# Altium project CONTROL BARRAS DE CONTEO.PrjPcb
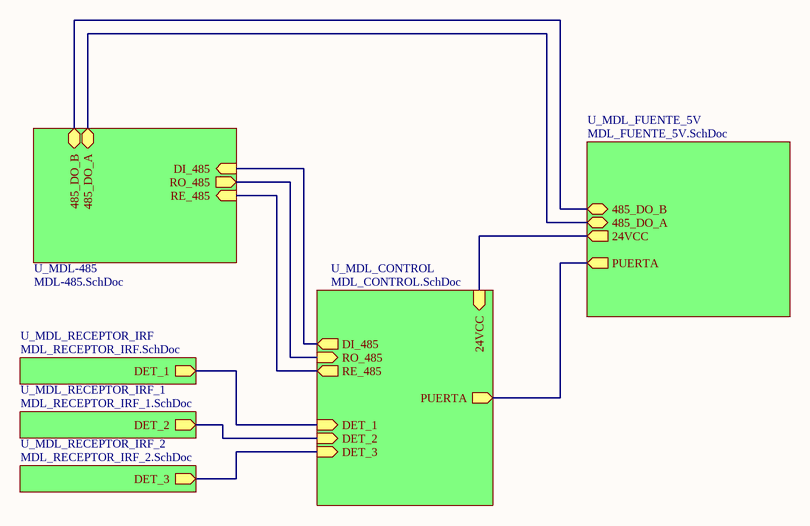
[diagram p0: CPBCC.SchDoc]
5 sheets, 43 parts. Net scope: hierarchical (ports join the sheet entries above them; power ports are global).
Board file: PCB_CPU_1.PcbDoc
Sheets:
  CPBCC.SchDoc
    U_MDL_CONTROL = MDL_CONTROL.SchDoc
    U_MDL-485 = MDL-485.SchDoc
    U_MDL_FUENTE_5V = MDL_FUENTE_5V.SchDoc
    U_MDL_RECEPTOR_IRF = MDL_RECEPTOR_IRF.SchDoc

## Sheet CPBCC.SchDoc
size A4

### Sub-sheets
U_MDL-485 = MDL-485.SchDoc: RO_485 (out), RE_485 (in), DI_485 (in), 485_DO_B (bidir), 485_DO_A (bidir)
U_MDL_CONTROL = MDL_CONTROL.SchDoc: DI_485 (out), RO_485 (in), RE_485 (out), DET_1 (in), DET_2 (in), DET_3 (in), 24VCC (in), PUERTA (out)
U_MDL_FUENTE_5V = MDL_FUENTE_5V.SchDoc: 485_DO_A, PUERTA (out), 485_DO_B, 24VCC (out)
U_MDL_RECEPTOR_IRF = MDL_RECEPTOR_IRF.SchDoc: DET_1 (out)
U_MDL_RECEPTOR_IRF_1 = MDL_RECEPTOR_IRF_1.SchDoc (file not in this document): DET_2 (out)
U_MDL_RECEPTOR_IRF_2 = MDL_RECEPTOR_IRF_2.SchDoc (file not in this document): DET_3 (out)

### Nets
24VCC: sheet U_MDL_CONTROL/24VCC, sheet U_MDL_FUENTE_5V/24VCC
485_DO_A: sheet U_MDL-485/485_DO_A, sheet U_MDL_FUENTE_5V/485_DO_A
485_DO_B: sheet U_MDL-485/485_DO_B, sheet U_MDL_FUENTE_5V/485_DO_B
DET_1: sheet U_MDL_CONTROL/DET_1, sheet U_MDL_RECEPTOR_IRF/DET_1
DET_2: sheet U_MDL_CONTROL/DET_2, sheet U_MDL_RECEPTOR_IRF_1/DET_2
DET_3: sheet U_MDL_CONTROL/DET_3, sheet U_MDL_RECEPTOR_IRF_2/DET_3
DI_485: sheet U_MDL_CONTROL/DI_485, sheet U_MDL-485/DI_485
PUERTA: sheet U_MDL_CONTROL/PUERTA, sheet U_MDL_FUENTE_5V/PUERTA
RE_485: sheet U_MDL_CONTROL/RE_485, sheet U_MDL-485/RE_485
RO_485: sheet U_MDL_CONTROL/RO_485, sheet U_MDL-485/RO_485

## Sheet MDL_CONTROL.SchDoc
size A3
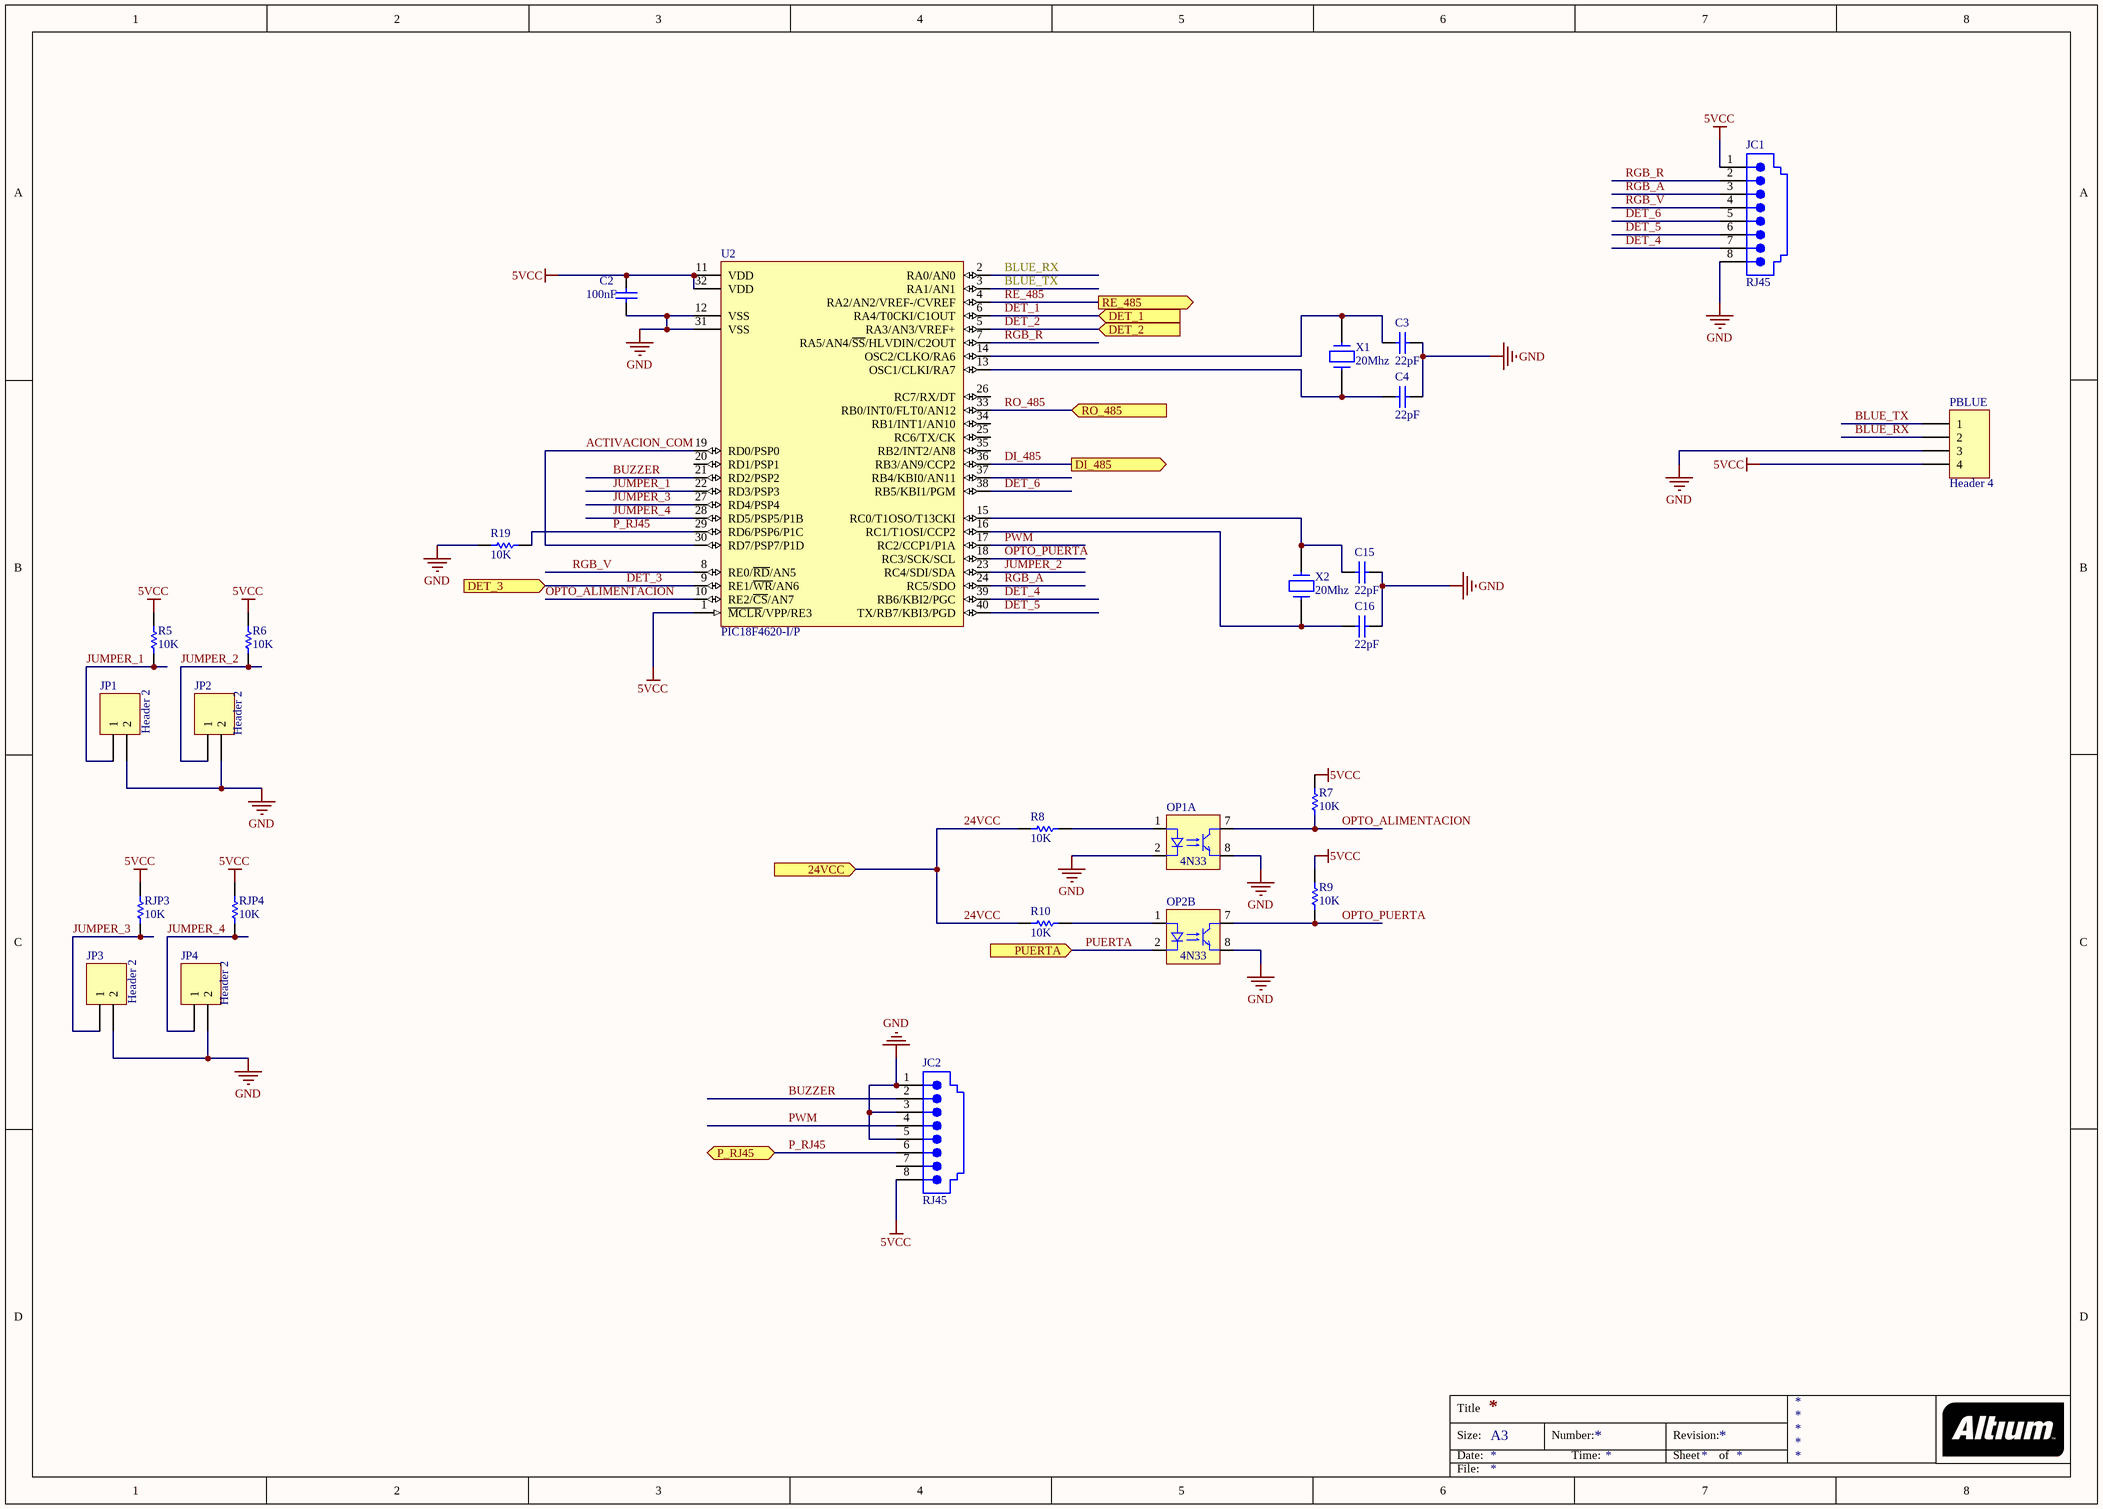
[diagram p1: MDL_CONTROL.SchDoc]

### Parts
C2  value 100nF  [VP44-2.5]  (hidden comment: VP44BY224JB)
C3  value 22pF  [VP31-2.5]  (hidden comment: VP31BA220JB)
C4  value 22pF  [VP31-2.5]  (hidden comment: VP31BA220JB)
C15  value 22pF  [VP31-2.5]  (hidden comment: VP31BA220JB)
C16  value 22pF  [VP31-2.5]  (hidden comment: VP31BA220JB)
JC1  RJ45  [15-43-6233]
JC2  RJ45  [15-43-6233]
JP1  Header 2  [HDR1X2]
JP2  Header 2  [HDR1X2]
JP3  Header 2  [HDR1X2]
JP4  Header 2  [HDR1X2]
OP1  4N33  [4n35_4n33_6pines]  (part A of 2)
OP2  4N33  [4n35_4n33_6pines]  (part B of 2)
PBLUE  Header 4  [HDR1X4]
R5  value 10K  [AXIAL-0.3]  (hidden comment: Res)
R6  value 10K  [AXIAL-0.3]  (hidden comment: Res)
R7  value 10K  [AXIAL-0.3]  (hidden comment: Res)
R8  value 10K  [AXIAL-0.3]  (hidden comment: Res)
R9  value 10K  [AXIAL-0.3]  (hidden comment: Res)
R10  value 10K  [AXIAL-0.3]  (hidden comment: Res)
R19  value 10K  [AXIAL-0.3]  (hidden comment: Res)
RJP3  value 10K  [AXIAL-0.3]  (hidden comment: Res)
RJP4  value 10K  [AXIAL-0.3]  (hidden comment: Res)
U2  PIC18F4620-I/P  [PDIP600-P40]
X1  20Mhz  [XTAL-1]
X2  20Mhz  [XTAL-1]

### Ports
24VCC (in), DET_1 (in), DET_2 (in), DET_3 (in), DI_485 (out), P_RJ45 (bidir), PUERTA (in), RE_485 (out), RO_485 (in)

### Nets
5VCC: C2.1 JC1.1 JC2.8 PBLUE.4 R5.2 R6.2 R7.2 R9.2 RJP3.2 RJP4.2 U2.1(~{MCLR}/VPP/RE3) U2.11(VDD) U2.32(VDD)
GND: C2.2 C3.2 C4.1 C15.2 C16.1 JC1.8 JC2.1 JC2.3 JC2.5 JP1.2 JP2.2 JP3.2 JP4.2 OP1.2(K) OP1.8(E) OP2.8(E) PBLUE.3 R19.2 U2.12(VSS) U2.31(VSS)
24VCC: R8.1 R10.1 ; port 24VCC
ACTIVACION_COM: U2.19(RD0/PSP0) U2.30(RD7/PSP7/P1D)
BLUE_RX: PBLUE.2 U2.2(RA0/AN0)
BLUE_TX: PBLUE.1 U2.3(RA1/AN1)
BUZZER: JC2.2 U2.21(RD2/PSP2)
DET_1: U2.6(RA4/T0CKI/C1OUT) ; port DET_1
DET_2: U2.5(RA3/AN3/VREF+) ; port DET_2
DET_3: U2.9(RE1/~{WR}/AN6) ; port DET_3
DET_4: JC1.7 U2.39(RB6/KBI2/PGC)
DET_5: JC1.6 U2.40(TX/RB7/KBI3/PGD)
DET_6: JC1.5 U2.38(RB5/KBI1/PGM)
DI_485: U2.36(RB3/AN9/CCP2) ; port DI_485
JUMPER_1: JP1.1 R5.1 U2.22(RD3/PSP3)
JUMPER_2: JP2.1 R6.1 U2.23(RC4/SDI/SDA)
JUMPER_3: JP3.1 RJP3.1 U2.27(RD4/PSP4)
JUMPER_4: JP4.1 RJP4.1 U2.28(RD5/PSP5/P1B)
OPTO_ALIMENTACION: OP1.7(C) R7.1 U2.10(RE2/~{CS}/AN7)
OPTO_PUERTA: OP2.7(C) R9.1 U2.18(RC3/SCK/SCL)
P_RJ45: JC2.6 R19.1 U2.29(RD6/PSP6/P1C) ; port P_RJ45
PUERTA: OP2.2(K) ; port PUERTA
PWM: JC2.4 U2.17(RC2/CCP1/P1A)
RE_485: U2.4(RA2/AN2/VREF-/CVREF) ; port RE_485
RGB_A: JC1.3 U2.24(RC5/SDO)
RGB_R: JC1.2 U2.7(RA5/AN4/~{SS}/HLVDIN/C2OUT)
RGB_V: JC1.4 U2.8(RE0/~{RD}/AN5)
RO_485: U2.33(RB0/INT0/FLT0/AN12) ; port RO_485
NetC3_1: C3.1 U2.14(OSC2/CLKO/RA6) X1.1
NetC4_2: C4.2 U2.13(OSC1/CLKI/RA7) X1.2
NetC15_1: C15.1 U2.15(RC0/T1OSO/T13CKI) X2.1
NetC16_2: C16.2 U2.16(RC1/T1OSI/CCP2) X2.2
NetOP1_1: OP1.1(A) R8.2
NetOP2_1: OP2.1(A) R10.2

Not connected (* = marked no-connect by the designer): JC2 7; U2 20(RD1/PSP1) 25(RC6/TX/CK) 26(RC7/RX/DT) 34(RB1/INT1/AN10) 35(RB2/INT2/AN8) 37(RB4/KBI0/AN11)

### Notes on the sheet
- Title
- Size:
- Date:
- A3
- Number:
- Time:
- Revision:
- Sheet
- of
- File:

### Library data of the parts
C2 = VP44BY224JB: Dipped Radial Multilayer Ceramic Capacitor X7R: 220nF, 100V; Published: 17-Dec-2003; DatasheetDocument: 4-Feb-2002; PackageDocument: 4-Feb-2002; PackageReference: VP44-2.5; Publisher: Altium Limited; ComponentLink1Description: Manufacturer Link; ComponentLink1URL: http://www.vishay.com/
C3 C4 C15 C16 = VP31BA220JB: Dipped Radial Multilayer Ceramic Capacitor COG (NPO): 22pF, 100V; Note: See Datasheet for other packages & tolerances; Published: 17-Dec-2003; DatasheetDocument: 2-Jan-2002; PackageDocument: 8-Feb-2002; PackageReference: VP31-2.5; Publisher: Altium Limited; ComponentLink1Description: Manufacturer Link; ComponentLink1URL: http://www.vishay.com/
JC1 JC2 = 15-43-6233: Right Angle, Standard Profile, RJ45-Keyed, Flange Mount PCB Jack; Ports: 1; Positions/Loaded: Port1 - 8 Keyed/8; PerformanceCategory: 3; PCB_Mounting: Thru-Hole; ComponentAvailability: Obsolete; DrillSize: Nominal, Rounded to nearest 0.05mm; PCB_Layout: Complies with Manufacturer's Recommendation.; Published: 25-Jun-2002; DatasheetDocument: 18-Dec-2001; PackageDocument: 18-Dec-2001; PackageReference: 15-43-6233; Publisher: Altium Limited; ComponentLink1Description: Manufacturer Link; ComponentLink1URL: http://www.molex.com/; ComponentLink2Description: Datasheet; ComponentLink2URL: http://www.molex.com/cmc_upload/common_files/1212003_catalogmx41314.pdf; ComponentLink3Description: Iges Model; ComponentLink3URL: http://www.molex.com/pdm_docs/igs/15-43-6233_igs.zip
JP1-JP4 = Header 2: Header, 2-Pin; LatestRevisionDate: 17-Jul-2002; LatestRevisionNote: Re-released for DXP Platform.; Publisher: Altium Limited
OP1 OP2 = ILD74: Optocoupler, Phototransistor Output, Dual Channel, TTL Compatible, Pb-free; Note: Coupling Capacitance, 0.5 pF; Note: Transfer Ratio, 35 % Typical; Published: 6-Oct-2005; DatasheetDocument: Rev. 1.4, Oct-2004; PackageDocument: Dec-2003; PackageReference: DIP8; Publisher: Altium Limited; ComponentLink1Description: Manufacturer Link; ComponentLink1URL: http://www.vishay.com/optocouplers/list/product-83640/; ComponentLink2Description: Datasheet; ComponentLink2URL: http://www.vishay.com/docs/83640/83640.pdf
PBLUE = Header 4: Header, 4-Pin; LatestRevisionDate: 17-Jul-2002; LatestRevisionNote: Re-released for DXP Platform.; Publisher: Altium Limited
R5-R10 R19 RJP3 RJP4 = Res1: Resistor; Published: 8-Jun-2000; LatestRevisionDate: 17-Jul-2002; LatestRevisionNote: Re-released for DXP Platform.; PackageReference: AXIAL-0.3; Publisher: Altium Limited
U2 = PIC18F4620-I/P: Enhanced Flash Microcontroller with 10-Bit A/D and nanoWatt Technology, 64K Flash, 40-Pin PDIP, Industrial Temperature Range; FirstPublished: 29-Jan-2009; DatasheetVersion: revE, May-2008; PackageVersion: revBB, Aug-2009; PackageReference: PDIP600-P40; Publisher: Altium Limited; PackageDescription: 40-Lead Plastic Dual In-Line (P) - 600 mil Body [PDIP]; Supplier 1: Digi-Key; Supplier Part Number 1: PIC18F4620-I/P-ND; Supplier 2: Farnell; Supplier Part Number 2: 1660064; Supplier 3: Farnell; Supplier Part Number 3: 1212704; Supplier 4: Newark; Supplier Part Number 4: 89H0709; ComponentLink1Description: Datasheet; ComponentLink1URL: http://ww1.microchip.com/downloads/en/DeviceDoc/39626e.pdf; ComponentLink2Description: Packaging Specification; ComponentLink2URL: http://www.microchip.com/stellent/groups/techpub_sg/documents/packagingspec/en012702.pdf; ComponentLink3Description: Microchip.com Home; ComponentLink3URL: http://www.microchip.com/
X1 X2 = Cristal de cuarzo: X1: 20Mhz

## Sheet MDL-485.SchDoc
size A4; DocumentNumber: 4; SheetNumber: 4
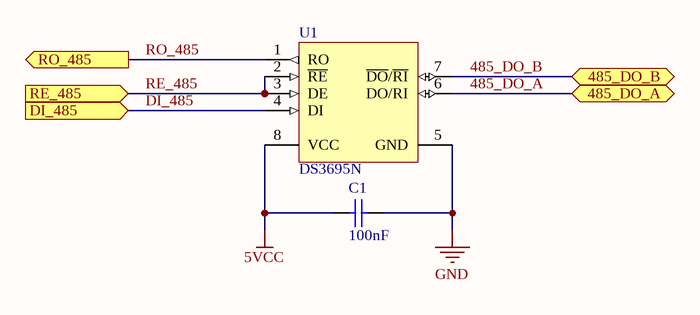
[diagram p2: MDL-485.SchDoc]

### Parts
C1  value 100nF  [VP44-2.5]  (hidden comment: VP44BY224JB)
U1  DS3695N  [N08E]

### Ports
485_DO_A (bidir), 485_DO_B (bidir), DI_485 (in), RE_485 (in), RO_485 (out)

### Nets
5VCC: C1.1 U1.8(VCC)
GND: C1.2 U1.5(GND)
485_DO_A: U1.6(DO/RI) ; port 485_DO_A
485_DO_B: U1.7(~{DO}/~{RI}) ; port 485_DO_B
DI_485: U1.4(DI) ; port DI_485
RE_485: U1.2(~{RE}) U1.3(DE) ; port RE_485
RO_485: U1.1(RO) ; port RO_485

### Library data of the parts
C1 = VP44BY224JB: as C2 on sheet MDL_CONTROL; Published: 17-Dec-2003; DatasheetDocument: 4-Feb-2002; PackageDocument: 4-Feb-2002; PackageReference: VP44-2.5; Publisher: Altium Limited; ComponentLink1Description: Manufacturer Link; ComponentLink1URL: http://www.vishay.com/
U1 = DS3695N: Multipoint RS485/RS422 Transceiver/Repeater; Manufacturer: National Semiconductor; CompType: Interface IC; PackageTopMarking: NSUZXYTT*DS3695N; PowerWise: N; Published: 4-Dec-2008; DatasheetVersion: May-1998; PackageVersion: revG, May-2006; PackageReference: N08E; Publisher: Altium Limited; PackageDescription: MDIP, .365 x .250 x .130in, 8 Lead, .100in Pitch; PartNumber: DS3695N; RoHS: O; PinCount: 8; DigiKeyPartNumber: DS3695N-ND; Code_JEDEC: MS-001-BA; ComponentLink1Description: DS3695 Datasheet; ComponentLink1URL: http://www.national.com/ds/DS/DS3695.pdf; ComponentLink2Description: DS3695 Web Page; ComponentLink2URL: http://www.national.com/pf/DS/DS3695.html; ComponentLink3Description: N08E Package Page; ComponentLink3URL: http://www.national.com/packaging/folders/n08e.html

## Sheet MDL_FUENTE_5V.SchDoc
size A4
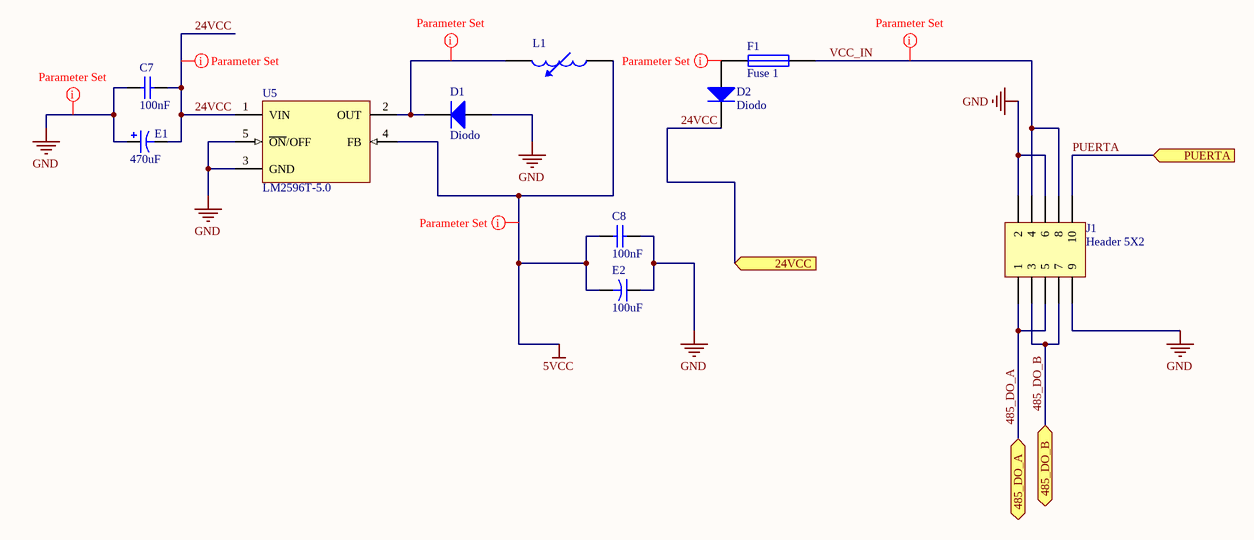
[diagram p3: MDL_FUENTE_5V.SchDoc]

### Parts
C7  value 100nF  [VP44-2.5]  (hidden comment: VP44BY224JB)
C8  value 100nF  [VP44-2.5]  (hidden comment: VP44BY224JB)
D1  Diodo  [1N4000]
D2  Diodo  [1N4000]
E1  value 470uF  [C1000UF]  (hidden comment: Cap Pol1)
E2  value 100uF  [C1UF]  (hidden comment: Cap2)
F1  Fuse 1  [FUSIBLE_BUSMATIC]
J1  Header 5X2  [FP_CON10]
L1  Inductor Adj  [Inductor_redondo]  (value not drawn)
U5  LM2596T-5.0  [FP_LM2596_D_PCB]

### Ports
24VCC (in), 485_DO_A, 485_DO_B, PUERTA (in)

### Nets
5VCC: C8.2 E2.2 L1.1 U5.4(FB)
GND: C7.2 C8.1 D1.1(A) E1.1 E2.1 J1.2 J1.6 J1.9 U5.3(GND) U5.5(~{ON}/OFF)
24VCC: C7.1 D2.2(K) E1.2 U5.1(VIN) ; port 24VCC
485_DO_A: J1.1 J1.5 ; port 485_DO_A
485_DO_B: J1.3 J1.7 ; port 485_DO_B
PUERTA: J1.10 ; port PUERTA
VCC_IN: F1.2 J1.4 J1.8
NetD1_2: D1.2(K) L1.2 U5.2(OUT)
NetD2_1: D2.1(A) F1.1

### Layout directives
rule Width Constraint [Pref Width = 1.2mm    Min Width = 0.8mm    Max Width = 1.5mm]: GND
rule Width Constraint [Pref Width = 1.5mm    Min Width = 1.2mm    Max Width = 2mm]: 24VCC, VCC_IN
rule Width Constraint [Pref Width = 1.2mm    Min Width = 0.8mm    Max Width = 1.5mm]; rule Undefined: 5VCC
rule Width Constraint [Pref Width = 1.5mm    Min Width = 0.8mm    Max Width = 1.5mm]: NetD1_2
rule Width Constraint [Pref Width = 1.8mm    Min Width = 1.2mm    Max Width = 2mm]: NetD2_1

### Library data of the parts
C7 C8 = VP44BY224JB: as C2 on sheet MDL_CONTROL; Published: 17-Dec-2003; DatasheetDocument: 4-Feb-2002; PackageDocument: 4-Feb-2002; PackageReference: VP44-2.5; Publisher: Altium Limited; ComponentLink1Description: Manufacturer Link; ComponentLink1URL: http://www.vishay.com/
D1 D2 = Diodo: Diodo rectificador
E1 = Cap Pol1: Polarized Capacitor (Radial); Published: 8-Jun-2000; LatestRevisionDate: 17-Jul-2002; LatestRevisionNote: Re-released for DXP Platform.; PackageReference: RB7.6-15; Publisher: Altium Limited
E2 = Cap2: Capacitor; Published: 23-Sep-2002; PackageReference: CAPR5-4X5; Publisher: Altium Limited; PackageDescription: Capacitor; 2 Leads
F1 = Fuse 1: Fuse; Published: 8-Jun-2000; LatestRevisionDate: 17-Jul-2002; LatestRevisionNote: Re-released for DXP Platform.; PackageReference: PIN-W2/E2.8; Publisher: Altium Limited; PackageDescription: Thru-Hole; 2 Leads
J1 = Header 5X2: Header, 5-Pin, Dual row; LatestRevisionDate: 17-Jul-2002; LatestRevisionNote: Re-released for DXP Platform.; Publisher: Altium Limited
L1 = Inductor Adj: Adjustable Inductor; Value: 10mH; Set Position: 0.5; Published: 24-Mar-1999; LatestRevisionDate: 17-Jul-2002; LatestRevisionNote: Re-released for DXP Platform.; PackageReference: AXIAL-0.8; Publisher: Altium Limited
U5 = LM2596T-5.0: SIMPLE SWITCHER Power Converter 150 KHz 3A Step-Down Voltage Regulator; Manufacturer: National Semiconductor; PackageTopMarking: NSUZXYTT*LM2596T*-5.0 P+; PowerWise: N; FirstPublished: 4-Dec-2008; DatasheetVersion: May-2002; PackageVersion: revA, Oct-1989; PackageReference: T05D; Publisher: Altium Limited; PackageDescription: TO-220, Molded, Stagger Bend, 5 Lead; CompType: Switcher; PartNumber: LM2596T-5.0; RoHS: O; PinCount: 5; DigiKeyPartNumber: LM2596T-5.0-ND; ComponentLink1Description: LM2596 Datasheet; ComponentLink1URL: http://www.national.com/ds/LM/LM2596.pdf; ComponentLink2Description: LM2596 Web Page; ComponentLink2URL: http://www.national.com/pf/LM/LM2596.html; ComponentLink3Description: T05D Package Page; ComponentLink3URL: http://www.national.com/packaging/folders/t05d.html

## Sheet MDL_RECEPTOR_IRF.SchDoc
size A4
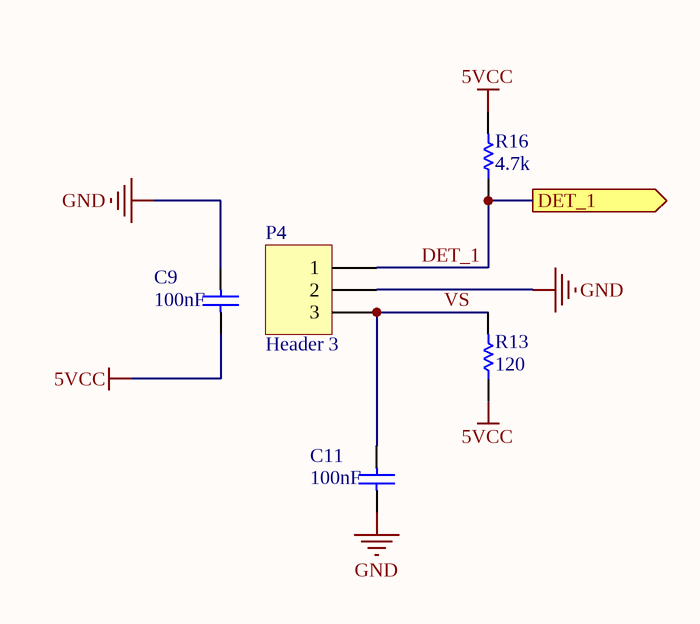
[diagram p4: MDL_RECEPTOR_IRF.SchDoc]

### Parts
C9  value 100nF  [VP44-2.5]  (hidden comment: VP44BY224JB)
C11  value 100nF  [VP44-2.5]  (hidden comment: VP44BY224JB)
P4  Header 3  [HDR1X3]
R13  value 120  [AXIAL-0.3]  (hidden comment: Res)
R16  value 4.7k  [AXIAL-0.3]  (hidden comment: Res)

### Ports
DET_1 (out)

### Nets
5VCC: C9.2 R13.1 R16.2
GND: C9.1 C11.2 P4.2
DET_1: P4.1 R16.1 ; port DET_1
VS: C11.1 P4.3 R13.2

### Library data of the parts
C9 C11 = VP44BY224JB: as C2 on sheet MDL_CONTROL; Published: 17-Dec-2003; DatasheetDocument: 4-Feb-2002; PackageDocument: 4-Feb-2002; PackageReference: VP44-2.5; Publisher: Altium Limited; ComponentLink1Description: Manufacturer Link; ComponentLink1URL: http://www.vishay.com/
P4 = Header 3: Header, 3-Pin; LatestRevisionDate: 17-Jul-2002; LatestRevisionNote: Re-released for DXP Platform.; Publisher: Altium Limited
R13 R16 = Res1: Resistor; Published: 8-Jun-2000; LatestRevisionDate: 17-Jul-2002; LatestRevisionNote: Re-released for DXP Platform.; PackageReference: AXIAL-0.3; Publisher: Altium Limited

## Nets that join several sheets
5VCC: MDL_CONTROL (13 pins), MDL-485 (C1.1 U1.8), MDL_FUENTE_5V (C8.2 E2.2 L1.1 U5.4), MDL_RECEPTOR_IRF (C9.2 R13.1 R16.2)
GND: MDL_CONTROL (20 pins), MDL-485 (C1.2 U1.5), MDL_FUENTE_5V (10 pins), MDL_RECEPTOR_IRF (C9.1 C11.2 P4.2)
24VCC: MDL_CONTROL (R8.1 R10.1), MDL_FUENTE_5V (C7.1 D2.2 E1.2 U5.1)
485_DO_A: MDL-485 (U1.6), MDL_FUENTE_5V (J1.1 J1.5)
485_DO_B: MDL-485 (U1.7), MDL_FUENTE_5V (J1.3 J1.7)
DET_1: MDL_CONTROL (U2.6), MDL_RECEPTOR_IRF (P4.1 R16.1)
DI_485: MDL_CONTROL (U2.36), MDL-485 (U1.4)
PUERTA: MDL_CONTROL (OP2.2), MDL_FUENTE_5V (J1.10)
RE_485: MDL_CONTROL (U2.4), MDL-485 (U1.2 U1.3)
RO_485: MDL_CONTROL (U2.33), MDL-485 (U1.1)